# EasyEDA schematic ShieldV1.2b.json

## Sheets
1 Main board
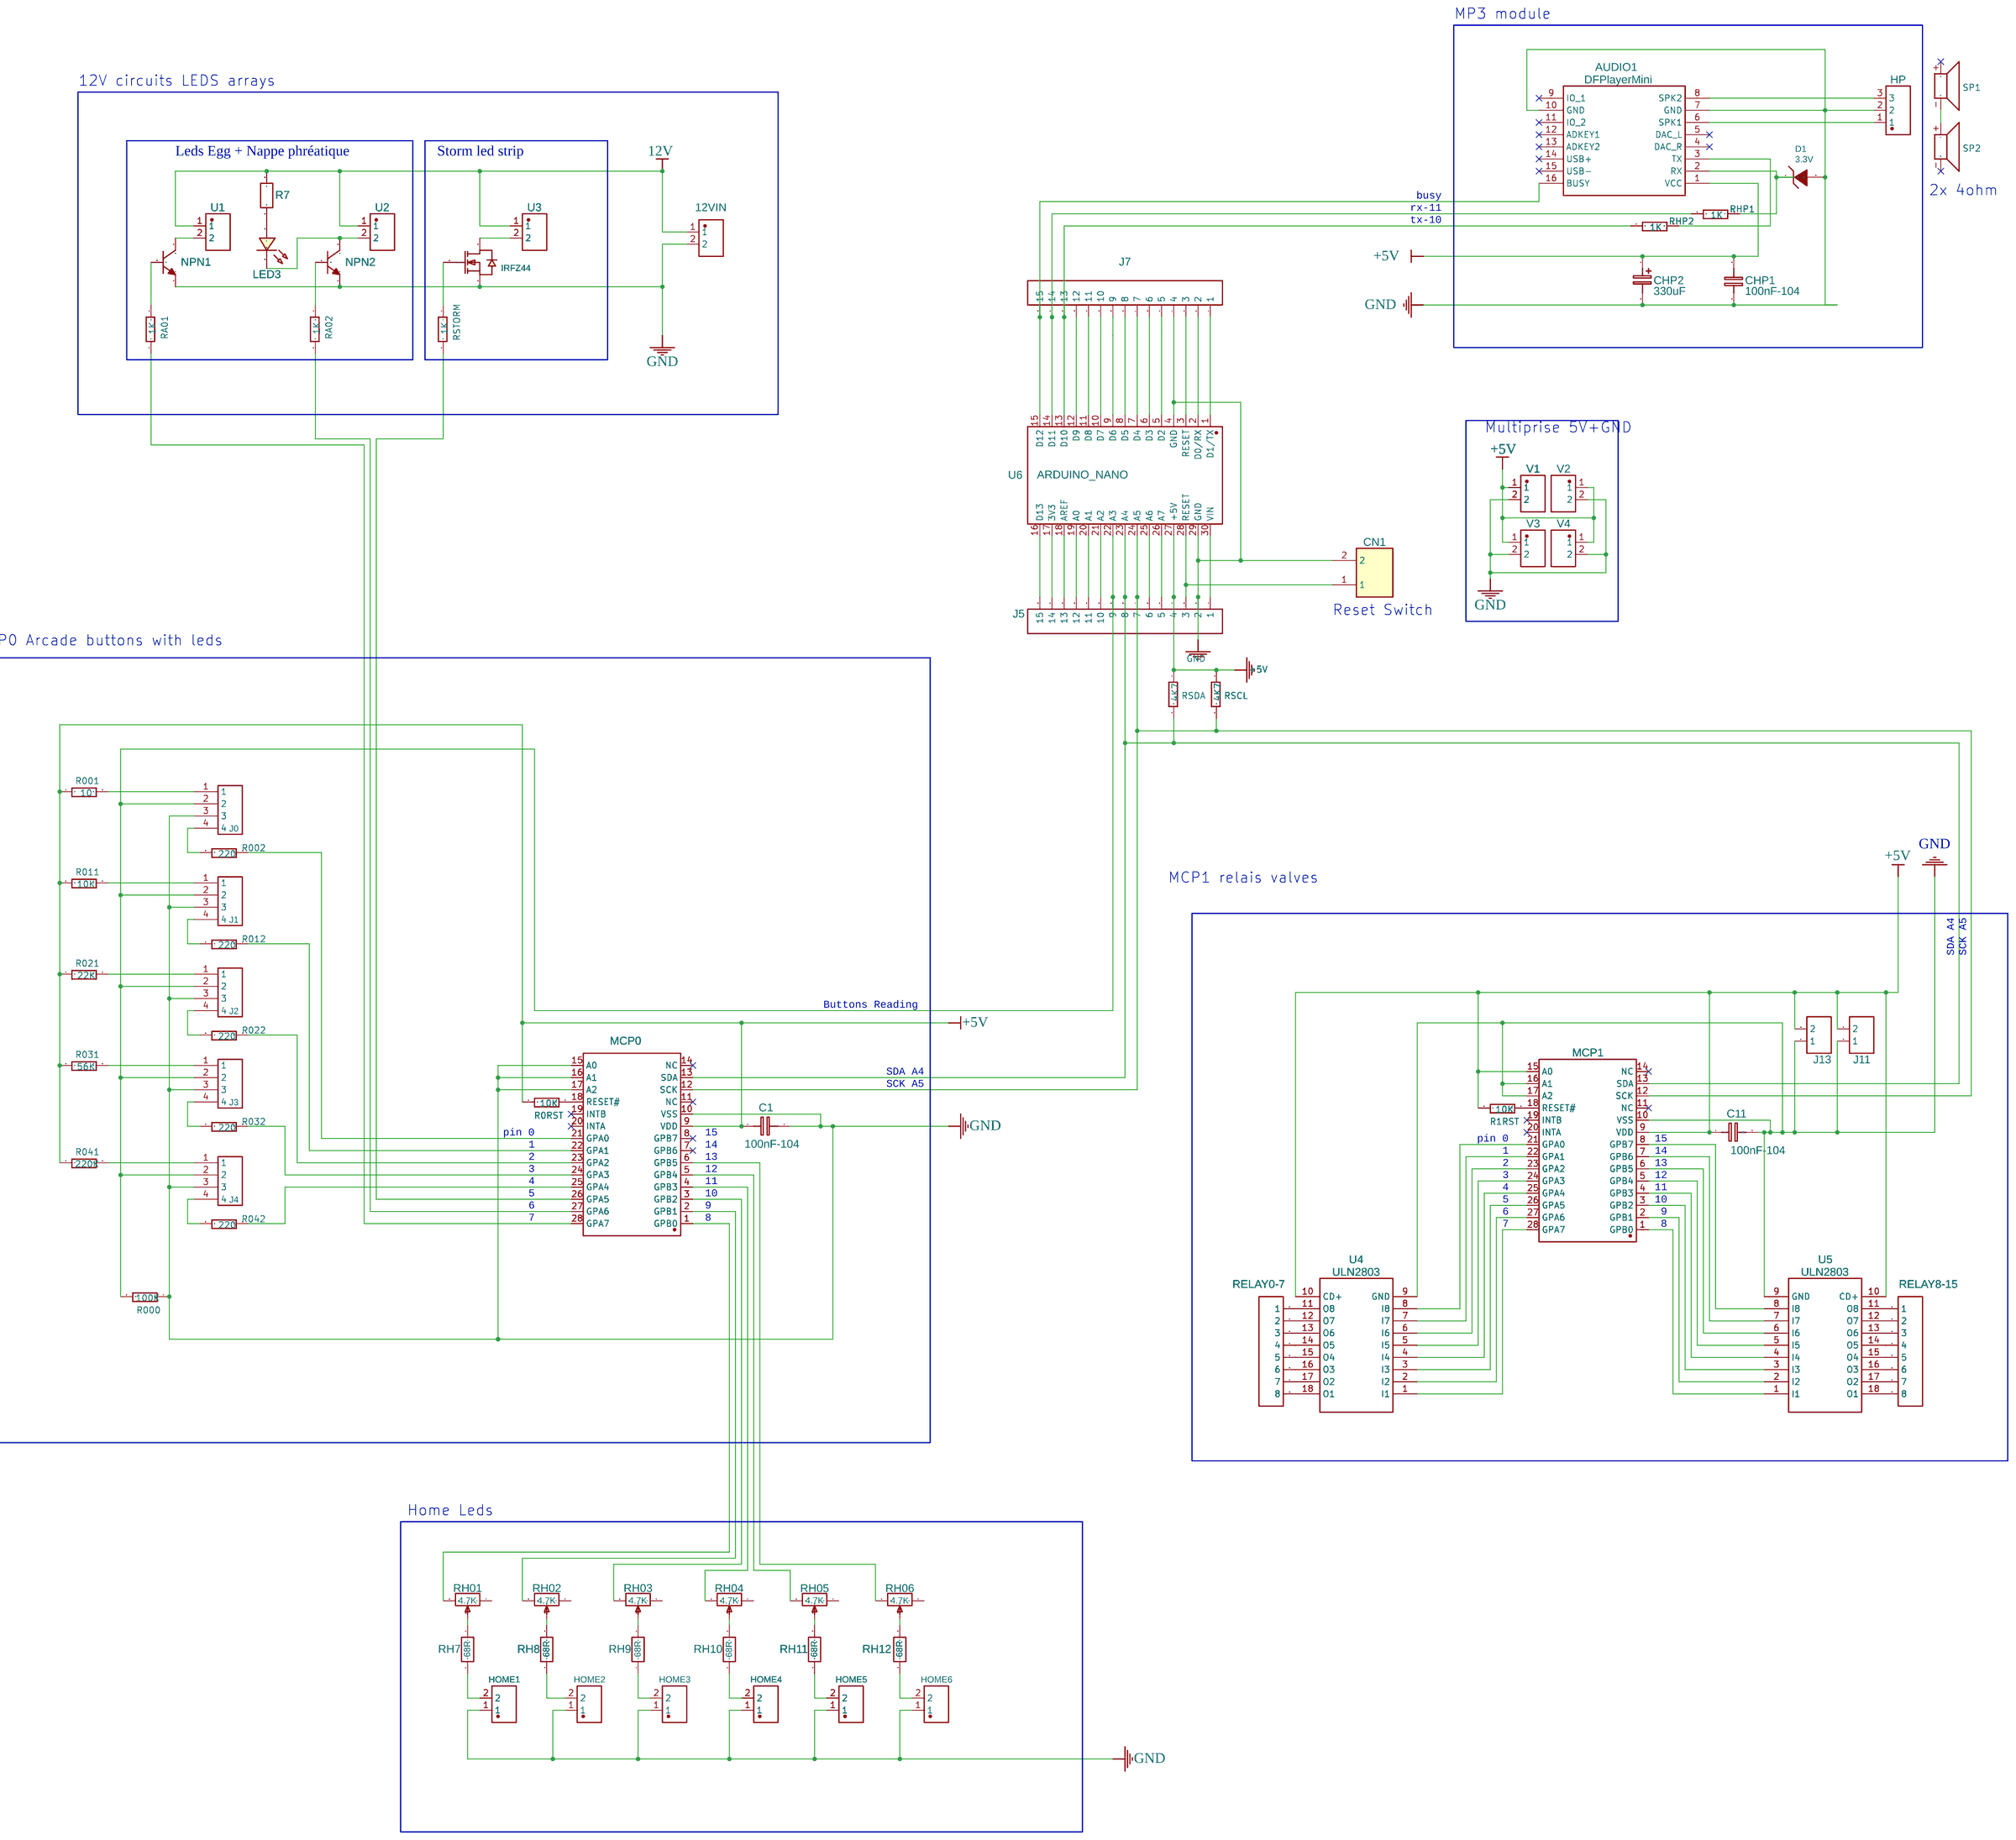
[diagram p0: Main board]
2 leds: TITLE: Sheet_2; REV: 1.0; Date: 2022-06-01; Sheet: 1/1; Drawn By: nicolas.de.barquin; Company: Your Company
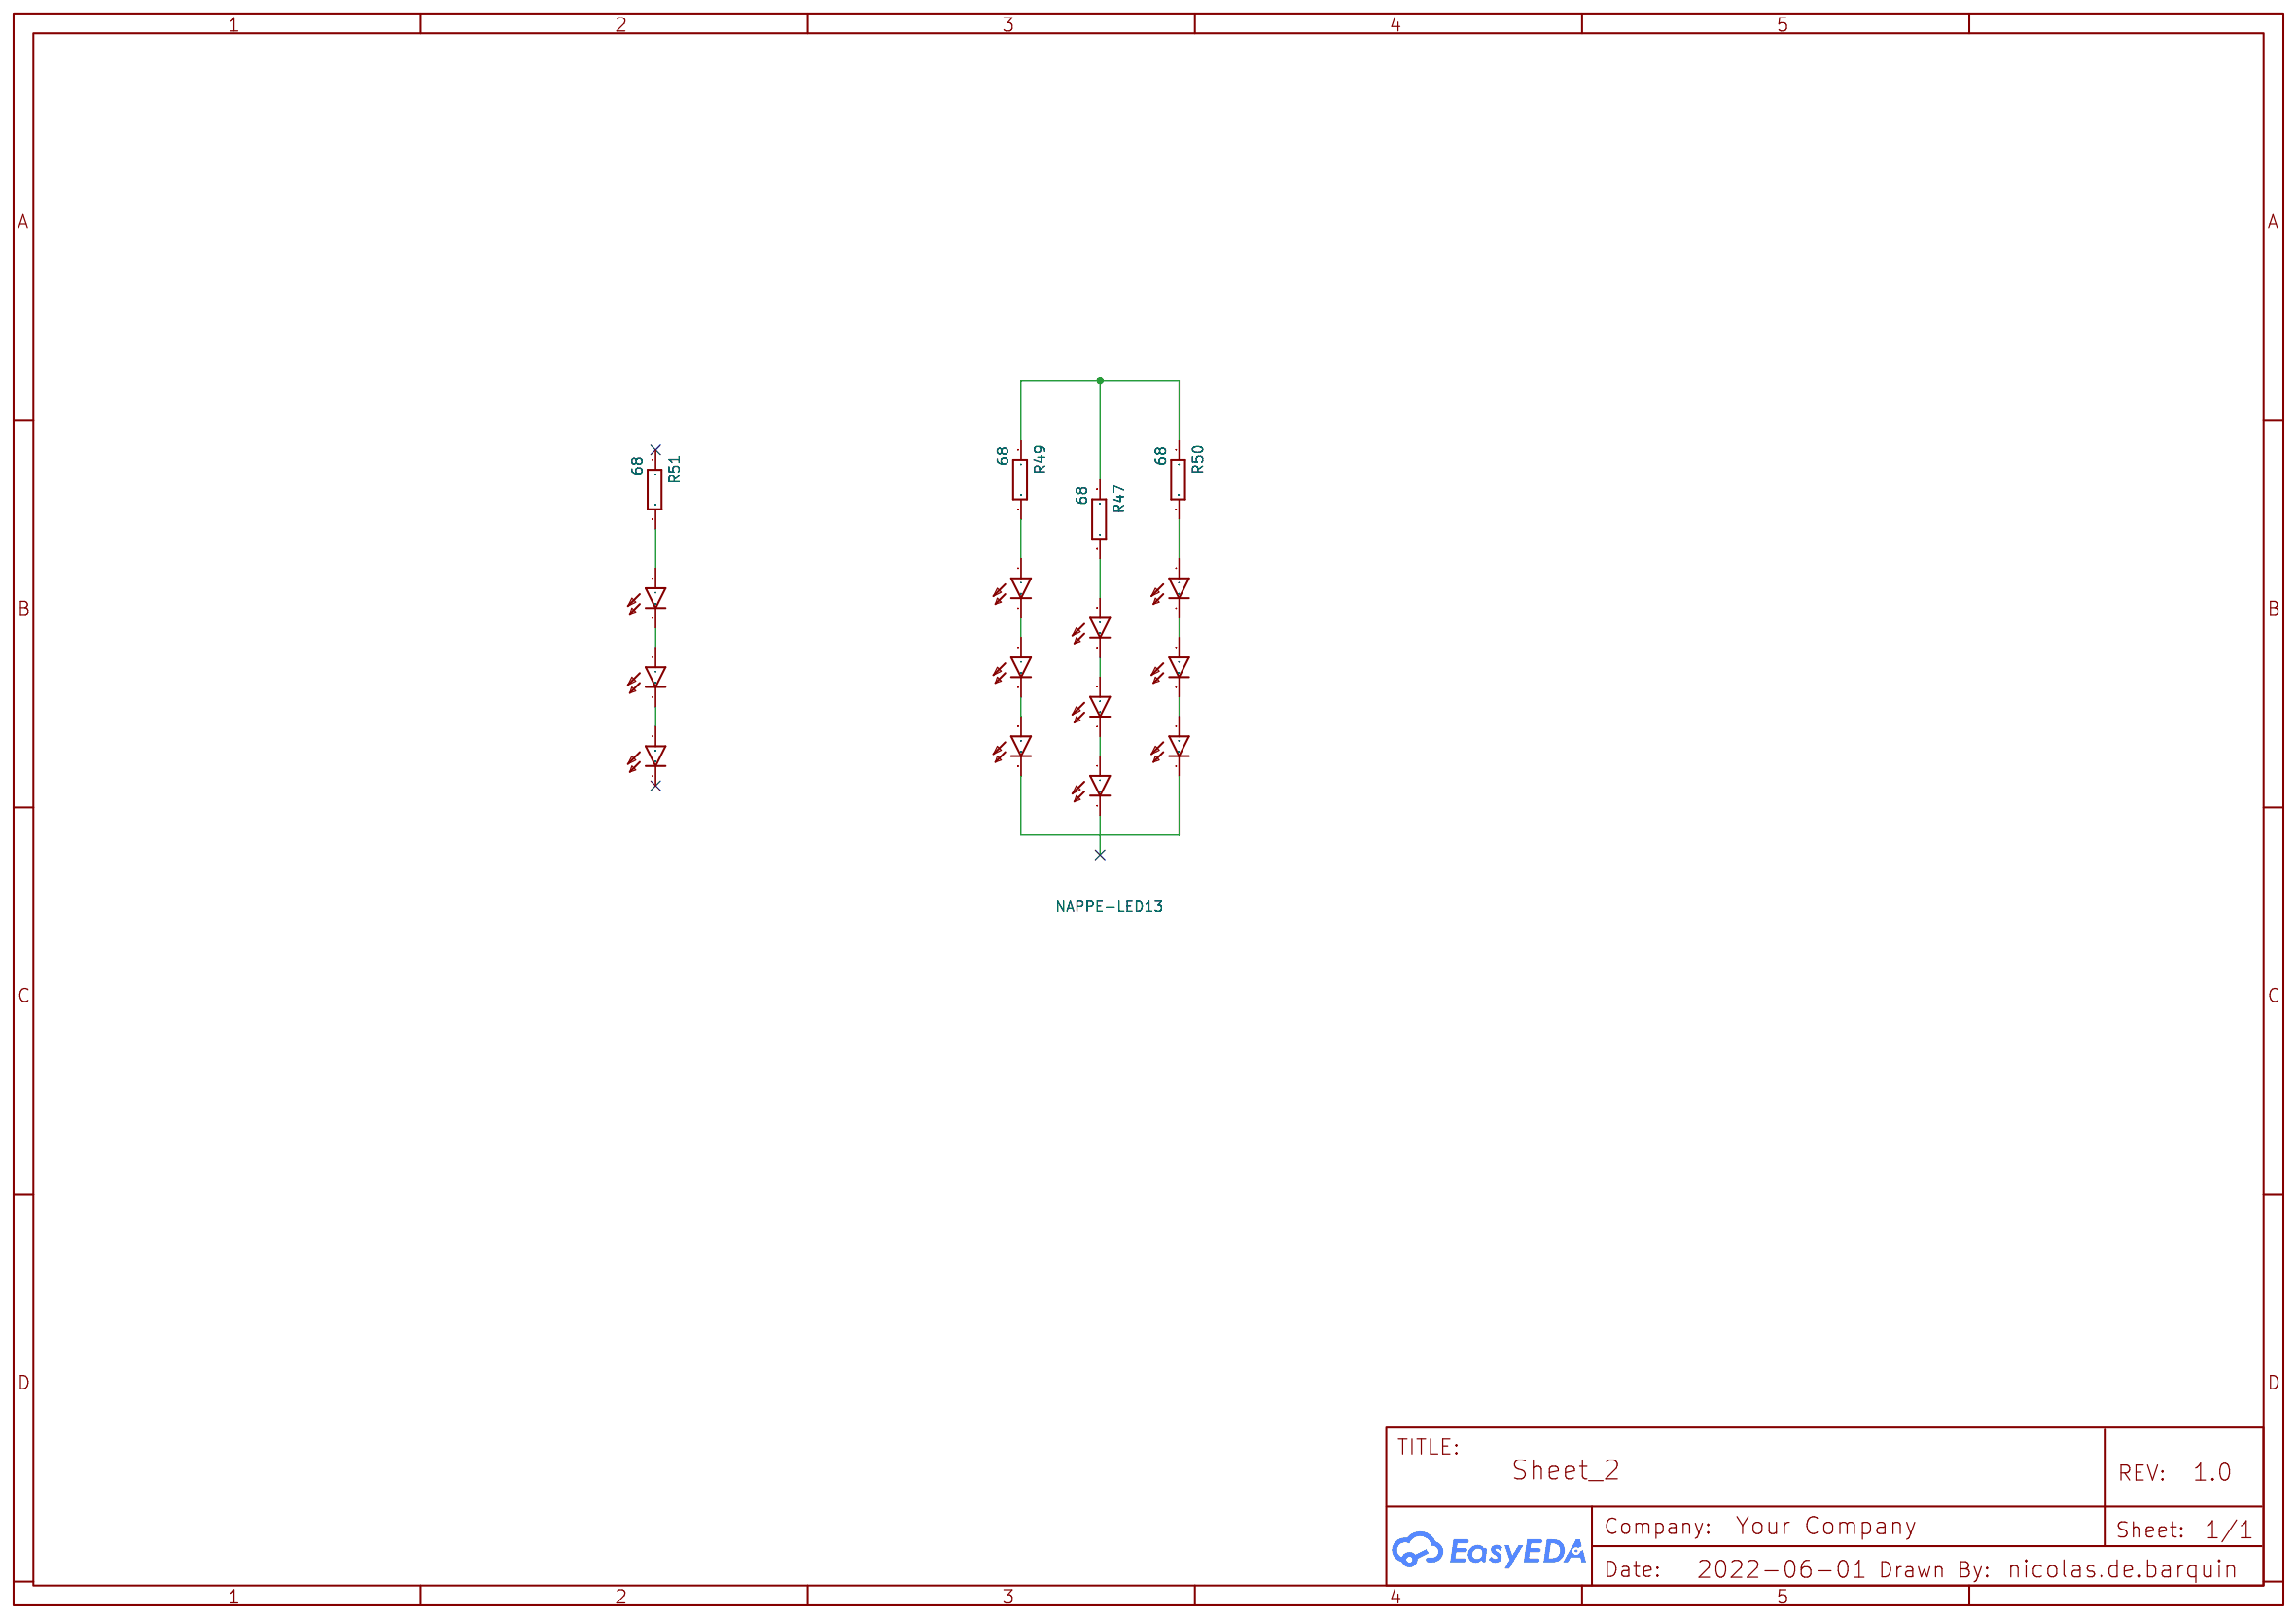
[diagram p1: leds]

## Parts
sheet leds
NAPPE-LED1  LED5MM  [LED5MM]
NAPPE-LED2  LED5MM  [LED5MM]
NAPPE-LED3  LED5MM  [LED5MM]
NAPPE-LED4  LED5MM  [LED5MM]
NAPPE-LED5  LED5MM  [LED5MM]
NAPPE-LED6  LED5MM  [LED5MM]
NAPPE-LED7  LED5MM  [LED5MM]
NAPPE-LED8  LED5MM  [LED5MM]
NAPPE-LED9  LED5MM  [LED5MM]
NAPPE-LED10  LED5MM  [LED5MM]
NAPPE-LED11  LED5MM  [LED5MM]
NAPPE-LED13  LED5MM  [LED5MM]
R47  68  [R0805]
R49  68  [R0805]
R50  68  [R0805]
R51  68  [R0805]
sheet Main board
12VIN  12V IN  [CONN-TH_P5.00_KF301-5.0-2P]
AUDIO1  DFPlayerMini  [DFPLAYER]
C1  100nF-104  [RAD-0.1]
C11  100nF-104  [RAD-0.1]
CHP1  100nF-104  [RAD-0.1]
CHP2  330uF  [CAP-D6.3×F2.5]
CN1  B2B-PH-K-S(LF)(SN)  [CONN-TH_B2B-PH-K-S]
D1  3.3V  [DO-41_BD2.4-L4.7-P8.70-D0.9-RD]
HOME1  B2B-PH-KL  [CONN-TH_2P-P2.00_2B-PH-KL]
HOME2  B2B-PH-KL  [CONN-TH_2P-P2.00_2B-PH-KL]
HOME3  B2B-PH-KL  [CONN-TH_2P-P2.00_2B-PH-KL]
HOME4  B2B-PH-KL  [CONN-TH_2P-P2.00_2B-PH-KL]
HOME5  B2B-PH-KL  [CONN-TH_2P-P2.00_2B-PH-KL]
HOME6  B2B-PH-KL  [CONN-TH_2P-P2.00_2B-PH-KL]
HP  JL300-50003U01  [CONN-TH_3P-P5.08_JL300-50003U01]
IRFZ44  IRFZ44NPBF  [TO-220-3_L10.0-W4.5-P2.54-L]
J0  XHB-4A(White)/4needle  [CONN-TH_4P_XHB-4A]
J1  XHB-4A(White)/4needle  [CONN-TH_4P_XHB-4A]
J2  XHB-4A(White)/4needle  [CONN-TH_4P_XHB-4A]
J3  XHB-4A(White)/4needle  [CONN-TH_4P_XHB-4A]
J4  XHB-4A(White)/4needle  [CONN-TH_4P_XHB-4A]
J5  HDR-M-2.54_1x15  [HDR-M-2.54_1X15]
J7  HDR-M-2.54_1x15  [HDR-M-2.54_1X15]
J11  HDR-M-2.54_1x2  [HDR-M-2.54_1X2]
J13  HDR-M-2.54_1x2  [HDR-M-2.54_1X2]
LED3  LED-0805_R  [LED0805_RED]
MCP0  MCP23017-E/SP  [DIP-28_L35.0-W6.5-P2.54-LS7.6-BL]
MCP1  MCP23017-E/SP  [DIP-28_L35.0-W6.5-P2.54-LS7.6-BL]
NPN1  2N4401_C15986  [TO-92-3_L4.9-W3.7-P1.27-L]
NPN2  2N4401_C15986  [TO-92-3_L4.9-W3.7-P1.27-L]
R000  100K  [R0805]
R0RST  10K  [R0805]
R001  10  [R0805]
R1RST  10K  [R0805]
R002  220  [R0805]
R7  1k  [R0805]
R011  10K  [R0805]
R012  220  [R0805]
R021  22K  [R0805]
R022  220  [R0805]
R031  56K  [R0805]
R032  220  [R0805]
R041  220K  [R0805]
R042  220  [R0805]
RA01  1K  [R0805]
RA02  1K  [R0805]
RELAY0-7  HDR-M-2.54_1x8  [HDR-M-2.54_1X8]
RELAY8-15  HDR-M-2.54_1x8  [HDR-M-2.54_1X8]
RH01  4.7K  [RES-ADJ-SMD_GF063P1]
RH02  4.7K  [RES-ADJ-SMD_GF063P1]
RH03  4.7K  [RES-ADJ-SMD_GF063P1]
RH04  4.7K  [RES-ADJ-SMD_GF063P1]
RH05  4.7K  [RES-ADJ-SMD_GF063P1]
RH06  4.7K  [RES-ADJ-SMD_GF063P1]
RH7  68R  [R0805]
RH8  68R  [R0805]
RH9  68R  [R0805]
RH10  68R  [R0805]
RH11  68R  [R0805]
RH12  68R  [R0805]
RHP1  1K  [R0805]
RHP2  1K  [R0805]
RSCL  4K7  [R0805]
RSDA  4K7  [R0805]
RSTORM  1K  [R0805]
SP1  SMS-1308MS-2-R  [SMS-1308MS-2-R]
SP2  SMS-1308MS-2-R  [SMS-1308MS-2-R]
U1  KF301-5.0-2P  [CONN-TH_P5.00_KF301-5.0-2P]
U2  KF301-5.0-2P  [CONN-TH_P5.00_KF301-5.0-2P]
U3  KF301-5.0-2P  [CONN-TH_P5.00_KF301-5.0-2P]
U4  ULN2803  [DIP-18_L23.0-W6.5-P2.54-LS7.6-BL]
U5  ULN2803  [DIP-18_L23.0-W6.5-P2.54-LS7.6-BL]
U6  ARDUINO_NANO  [COMM-TH_ARDUINO_NANO]
V1  12V IN  [CONN-TH_P5.00_KF301-5.0-2P]
V2  12V IN  [CONN-TH_P5.00_KF301-5.0-2P]
V3  12V IN  [CONN-TH_P5.00_KF301-5.0-2P]
V4  12V IN  [CONN-TH_P5.00_KF301-5.0-2P]

## Library data of the parts
12VIN U1-U3 V1-V4 = KF301-5.0-2P: Supplier: LCSC; Supplier Part: C474881; Manufacturer: Cixi Kefa Elec; Contributor: LCSC; JLCPCB Part Class: Extended Part
AUDIO1 = DFPlayerMini: catid: 20; Contributor: Outheader2; Manufacturer Part: DFPlayer mini; sim: true; Package Display: No
C1 C11 CHP1 = C_RAD-0.1_EU: Contributor: LCEDA_Lib
CHP2 = CE_TH_D6.3×F2.5_EU: Contributor: LCEDA_Lib
CN1 = B2B-PH-K-S(LF)(SN): Supplier: LCSC; Manufacturer: JST; Contributor: LCSC; Supplier Part: C131337; JLCPCB Part Class: Extended Part
D1 = 1N5921BG: Supplier: LCSC; Supplier Part: C232466; Manufacturer: ON Semicon; Contributor: LCSC; JLCPCB Part Class: Extended Part
HOME1-HOME6 = B2B-PH-KL: Supplier: LCSC; Supplier Part: C2683610; Manufacturer: JST; Contributor: LCSC; JLCPCB Part Class: Extended Part
HP = JL300-50003U01: Supplier: LCSC; Supplier Part: C394552; Manufacturer: JILN; Contributor: LCSC; JLCPCB Part Class: Extended Part
IRFZ44 = IRFZ44NPBF: Supplier: LCSC; Manufacturer: IR; Supplier Part: C2586; JLCPCB Part Class: Extended Part
J0-J4 = XHB-4A(White)/4needle: Supplier: LCSC; Manufacturer: BOOMELE; Supplier Part: C61277; JLCPCB Part Class: Extended Part
J5 J7 = HDR-M-2.54_1x15: Supplier Part: C124373; Supplier: LCSC; Contributor: LCEDA_Lib
J11 J13 = HDR-M-2.54_1x2: Supplier Part: C124375; Supplier: LCSC; Contributor: LCEDA_Lib
LED3 = LED-0805_R: Manufacturer: EVERLIGHT(台湾亿光); Manufacturer Part: 17-21SURC/S530-A3/TR8; Supplier Part: C72037; Contributor: LCEDA_Lib
MCP0 MCP1 = MCP23017-E/SP: Supplier: LCSC; Supplier Part: C647352; Manufacturer: Microchip Tech; Contributor: LCSC; JLCPCB Part Class: Extended Part
NPN1 NPN2 = 2N4401_C15986: Supplier: LCSC; Manufacturer: CJ; Manufacturer Part: 2N4401; Supplier Part: C15986; JLCPCB Part Class: Extended Part
R7 RH7-RH12 = R_0805_EU: Contributor: LCEDA_Lib
RELAY0-7 RELAY8-15 = HDR-M-2.54_1x8: Supplier Part: C190820; Supplier: LCSC; Contributor: LCEDA_Lib
RH01 RH02 RH03 RH04 RH05 RH06 = GF063P1-B101: Supplier: LCSC; Manufacturer: TOCOS; Supplier Part: C128075; Resistance(Ohms): 100; Resistance (Ohms): 100; JLCPCB Part Class: Extended Part
U4 U5 = ULN2803G-D18-T: Supplier: LCSC; Manufacturer: UTC; Supplier Part: C75528; JLCPCB Part Class: Extended Part
U6 = ARDUINO_NANO: Supplier: LCSC; Supplier Part: C9900017879; Manufacturer: null; JLCPCB Part Class: Extended Part; Contributor: lcsc

## Nets
12V: 12VIN.1 R7.2 U1.1 U2.1 U3.1
+5V: AUDIO1.1(VCC) C1.1 C11.1 CHP1.2 CHP2.1 J5.4 J11.2 J13.2 MCP0.9(VDD) MCP1.9(VDD) MCP1.15(A0) R0RST.2 R001.2 R1RST.2 R011.2 R021.2 R031.2 R041.2 RSCL.1 RSDA.1 U4.10(CD+) U5.10(CD+) U6.27(+5V) V1.1 V2.1 V3.1 V4.1
GND: 12VIN.2 AUDIO1.7(GND) AUDIO1.10(GND) C1.2 C11.2 CHP1.1 CHP2.2 CN1.2 D1.2(A) HOME1.1 HOME2.1 HOME3.1 HOME4.1 HOME5.1 HOME6.1 HP.2 IRFZ44.3(S) J0.3 J1.3 J2.3 J3.3 J4.3 J5.2 J7.4 J11.1 J13.1 MCP0.10(VSS) MCP0.15(A0) MCP0.16(A1) MCP0.17(A2) MCP1.10(VSS) MCP1.16(A1) MCP1.17(A2) NPN1.1(E) NPN2.1(E) R000.1 U4.9(GND) U5.9(GND) U6.4(GND) U6.29(GND) V1.2 V2.2 V3.2 V4.2
Net-(AUDIO1-2): AUDIO1.2(RX) D1.1(C) RHP1.1
Net-(AUDIO1-3): AUDIO1.3(TX) RHP2.2
Net-(AUDIO1-6): AUDIO1.6(SPK1) HP.1
Net-(AUDIO1-8): AUDIO1.8(SPK2) HP.3
Net-(AUDIO1-16): AUDIO1.16(BUSY) J7.15 U6.15(D12)
Net-(CN1-1): CN1.1 J5.3 U6.28(RESET)
Net-(HOME1-2): HOME1.2 RH7.1
Net-(HOME2-2): HOME2.2 RH8.1
Net-(HOME3-2): HOME3.2 RH9.1
Net-(HOME4-2): HOME4.2 RH10.1
Net-(HOME5-2): HOME5.2 RH11.1
Net-(HOME6-2): HOME6.2 RH12.1
Net-(IRFZ44-1): IRFZ44.1(G) RSTORM.1
Net-(IRFZ44-2): IRFZ44.2(D) U3.2
Net-(J0-1): J0.1 R001.1
Net-(J0-2): J0.2 J1.2 J2.2 J3.2 J4.2 J5.9 R000.2 U6.22(A3)
Net-(J0-4): J0.4 R002.2
Net-(J1-1): J1.1 R011.1
Net-(J1-4): J1.4 R012.2
Net-(J2-1): J2.1 R021.1
Net-(J2-4): J2.4 R022.2
Net-(J3-1): J3.1 R031.1
Net-(J3-4): J3.4 R032.2
Net-(J4-1): J4.1 R041.1
Net-(J4-4): J4.4 R042.2
Net-(J5-1): J5.1 U6.30(VIN)
Net-(J5-5): J5.5 U6.26(A7)
Net-(J5-6): J5.6 U6.25(A6)
Net-(J5-7): J5.7 MCP0.12(SCK) MCP1.12(SCK) RSCL.2 U6.24(A5)
Net-(J5-8): J5.8 MCP0.13(SDA) MCP1.13(SDA) RSDA.2 U6.23(A4)
Net-(J5-10): J5.10 U6.21(A2)
Net-(J5-11): J5.11 U6.20(A1)
Net-(J5-12): J5.12 U6.19(A0)
Net-(J5-13): J5.13 U6.18(AREF)
Net-(J5-14): J5.14 U6.17(3V3)
Net-(J5-15): J5.15 U6.16(D13)
Net-(J7-1): J7.1 U6.1(D1/TX)
Net-(J7-2): J7.2 U6.2(D0/RX)
Net-(J7-3): J7.3 U6.3(RESET)
Net-(J7-5): J7.5 U6.5(D2)
Net-(J7-6): J7.6 U6.6(D3)
Net-(J7-7): J7.7 U6.7(D4)
Net-(J7-8): J7.8 U6.8(D5)
Net-(J7-9): J7.9 U6.9(D6)
Net-(J7-10): J7.10 U6.10(D7)
Net-(J7-11): J7.11 U6.11(D8)
Net-(J7-12): J7.12 U6.12(D9)
Net-(J7-13): J7.13 RHP2.1 U6.13(D10)
Net-(J7-14): J7.14 RHP1.2 U6.14(D11)
Net-(LED3-1): LED3.1 R7.1
Net-(LED3-2): LED3.2 NPN2.3(C) U2.2
Net-(MCP0-1): MCP0.1(GPB0) RH01.3
Net-(MCP0-2): MCP0.2(GPB1) RH02.3
Net-(MCP0-3): MCP0.3(GPB2) RH03.3
Net-(MCP0-4): MCP0.4(GPB3) RH04.3
Net-(MCP0-5): MCP0.5(GPB4) RH05.3
Net-(MCP0-6): MCP0.6(GPB5) RH06.3
Net-(MCP0-18): MCP0.18(RESET#) R0RST.1
Net-(MCP0-21): MCP0.21(GPA0) R002.1
Net-(MCP0-22): MCP0.22(GPA1) R012.1
Net-(MCP0-23): MCP0.23(GPA2) R022.1
Net-(MCP0-24): MCP0.24(GPA3) R032.1
Net-(MCP0-25): MCP0.25(GPA4) R042.1
Net-(MCP0-26): MCP0.26(GPA5) RSTORM.2
Net-(MCP0-27): MCP0.27(GPA6) RA02.2
Net-(MCP0-28): MCP0.28(GPA7) RA01.2
Net-(MCP1-1): MCP1.1(GPB0) U5.1(I1)
Net-(MCP1-2): MCP1.2(GPB1) U5.2(I2)
Net-(MCP1-3): MCP1.3(GPB2) U5.3(I3)
Net-(MCP1-4): MCP1.4(GPB3) U5.4(I4)
Net-(MCP1-5): MCP1.5(GPB4) U5.5(I5)
Net-(MCP1-6): MCP1.6(GPB5) U5.6(I6)
Net-(MCP1-7): MCP1.7(GPB6) U5.7(I7)
Net-(MCP1-8): MCP1.8(GPB7) U5.8(I8)
Net-(MCP1-18): MCP1.18(RESET#) R1RST.1
Net-(MCP1-21): MCP1.21(GPA0) U4.8(I8)
Net-(MCP1-22): MCP1.22(GPA1) U4.7(I7)
Net-(MCP1-23): MCP1.23(GPA2) U4.6(I6)
Net-(MCP1-24): MCP1.24(GPA3) U4.5(I5)
Net-(MCP1-25): MCP1.25(GPA4) U4.4(I4)
Net-(MCP1-26): MCP1.26(GPA5) U4.3(I3)
Net-(MCP1-27): MCP1.27(GPA6) U4.2(I2)
Net-(MCP1-28): MCP1.28(GPA7) U4.1(I1)
Net-(NAPPE-LED1-A): NAPPE-LED1.A NAPPE-LED2.K(C)
Net-(NAPPE-LED1-K): NAPPE-LED1.K(C) NAPPE-LED13.A
Net-(NAPPE-LED2-A): NAPPE-LED2.A R47.2
Net-(NAPPE-LED3-A): NAPPE-LED3.A NAPPE-LED4.K(C)
Net-(NAPPE-LED3-K): NAPPE-LED3.K(C) NAPPE-LED6.K(C)
Net-(NAPPE-LED4-A): NAPPE-LED4.A NAPPE-LED5.K(C)
Net-(NAPPE-LED5-A): NAPPE-LED5.A R49.2
Net-(NAPPE-LED6-A): NAPPE-LED6.A NAPPE-LED7.K(C)
Net-(NAPPE-LED7-A): NAPPE-LED7.A NAPPE-LED8.K(C)
Net-(NAPPE-LED8-A): NAPPE-LED8.A R50.2
Net-(NAPPE-LED9-A): NAPPE-LED9.A NAPPE-LED10.K(C)
Net-(NAPPE-LED10-A): NAPPE-LED10.A NAPPE-LED11.K(C)
Net-(NAPPE-LED11-A): NAPPE-LED11.A R51.2
Net-(NPN1-2): NPN1.2(B) RA01.1
Net-(NPN1-3): NPN1.3(C) U1.2
Net-(NPN2-2): NPN2.2(B) RA02.1
Net-(R47-1): R47.1 R49.1 R50.1
Net-(RELAY0-7-1): RELAY0-7.1 U4.11(O8)
Net-(RELAY0-7-2): RELAY0-7.2 U4.12(O7)
Net-(RELAY0-7-3): RELAY0-7.3 U4.13(O6)
Net-(RELAY0-7-4): RELAY0-7.4 U4.14(O5)
Net-(RELAY0-7-5): RELAY0-7.5 U4.15(O4)
Net-(RELAY0-7-6): RELAY0-7.6 U4.16(O3)
Net-(RELAY0-7-7): RELAY0-7.7 U4.17(O2)
Net-(RELAY0-7-8): RELAY0-7.8 U4.18(O1)
Net-(RELAY8-15-1): RELAY8-15.1 U5.11(O8)
Net-(RELAY8-15-2): RELAY8-15.2 U5.12(O7)
Net-(RELAY8-15-3): RELAY8-15.3 U5.13(O6)
Net-(RELAY8-15-4): RELAY8-15.4 U5.14(O5)
Net-(RELAY8-15-5): RELAY8-15.5 U5.15(O4)
Net-(RELAY8-15-6): RELAY8-15.6 U5.16(O3)
Net-(RELAY8-15-7): RELAY8-15.7 U5.17(O2)
Net-(RELAY8-15-8): RELAY8-15.8 U5.18(O1)
Net-(RH01-2): RH01.2 RH7.2
Net-(RH02-2): RH02.2 RH8.2
Net-(RH03-2): RH03.2 RH9.2
Net-(RH04-2): RH04.2 RH10.2
Net-(RH05-2): RH05.2 RH11.2
Net-(RH06-2): RH06.2 RH12.2
Net-(SP1--): SP1.-(2) SP2.+(1)

Not connected (* = marked no-connect by the designer): AUDIO1 4(DAC_R)* 5(DAC_L)* 9(IO_1)* 11(IO_2)* 12(ADKEY1)* 13(ADKEY2)* 14(USB+)* 15(USB-)*; MCP0 7(GPB6)* 8(GPB7)* 11(NC)* 14(NC)* 19(INTB)* 20(INTA)*; MCP1 11(NC)* 14(NC)* 19(INTB)* 20(INTA)*; NAPPE-LED9 K(C)*; NAPPE-LED13 K(C); R51 1*; RH01 1; RH02 1; RH03 1; RH04 1; RH05 1; RH06 1; SP1 +(1)*; SP2 -(2)*

## Notes on the sheets
sheet 1
- MP3 module
- 12V circuits LEDS arrays
- Leds Egg + Nappe phréatique
- Storm led strip
- busy
- 2x 4ohm
- rx-11
- tx-10
- Multiprise 5V+GND
- Reset Switch
- MCP0 Arcade buttons with leds
- MCP1 relais valves
- SDA A4
- SCK A5
- Buttons Reading
- SDA A4
- SCK A5
- pin 0
- 15
- 1
- 14
- pin 0
- 15
- 2
- 13
- 1
- 14
- 3
- 12
- 2
- 3
- 12
- 13
- 4
- 11
- 4
- 11
- 5
- 6
- 10
- 9
- 5
- 10
- 7
- 8
- 6
- 9
- 7
- 8
- Home Leds
